# EAGLE design currentHack (EAGLE 8.3.1)
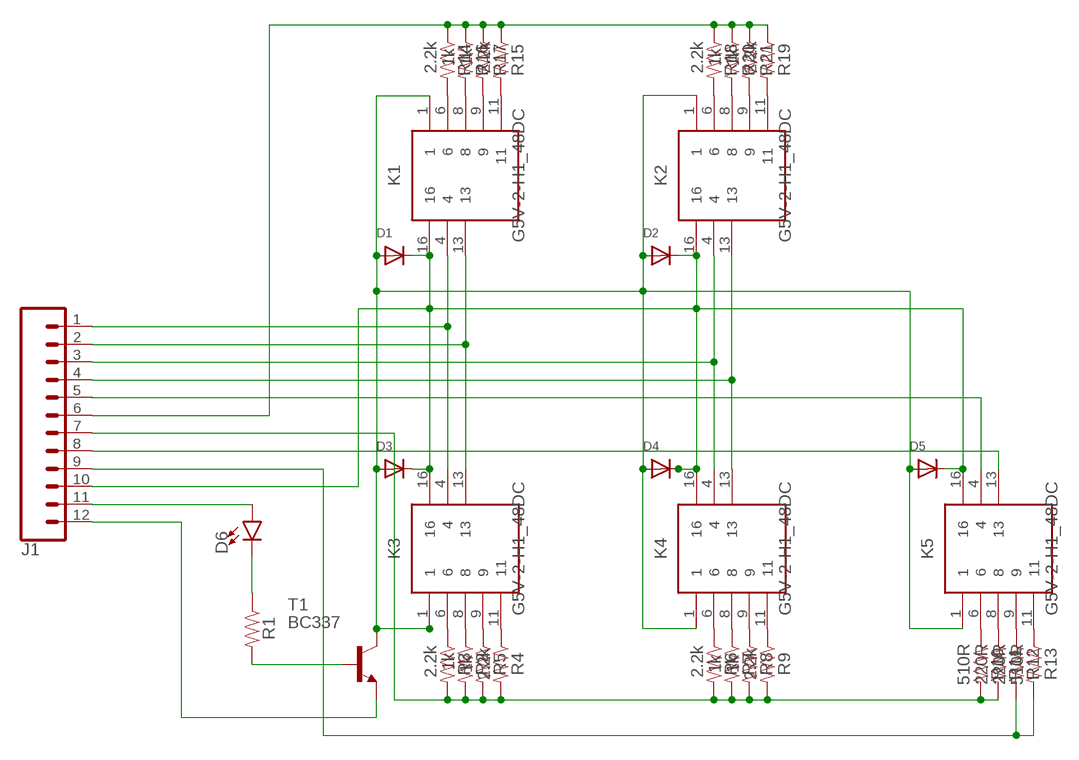
[diagram p0: schematic, sheet 1]

## Parts
D1  DIODEDO-1N4148  [DO-1N4148]
D2  DIODEDO-1N4148  [DO-1N4148]
D3  DIODEDO-1N4148  [DO-1N4148]
D4  DIODEDO-1N4148  [DO-1N4148]
D5  DIODEDO-1N4148  [DO-1N4148]
D6  LED3MM  [LED_3MM]
J1  CONN_12  [1X12]
K1  G5V-2-H1_48DC  [G5V-2-H1]
K2  G5V-2-H1_48DC  [G5V-2-H1]
K3  G5V-2-H1_48DC  [G5V-2-H1]
K4  G5V-2-H1_48DC  [G5V-2-H1]
K5  G5V-2-H1_48DC  [G5V-2-H1]
R1  RESISTORAXIAL-0.3  [AXIAL-0.3]
R2  1k  RESISTORAXIAL-0.3  [AXIAL-0.3]
R3  2.2k  RESISTORAXIAL-0.3  [AXIAL-0.3]
R4  2.2k  RESISTORAXIAL-0.3  [AXIAL-0.3]
R5  1k  RESISTORAXIAL-0.3  [AXIAL-0.3]
R6  2.2k  RESISTORAXIAL-0.3  [AXIAL-0.3]
R7  1k  RESISTORAXIAL-0.3  [AXIAL-0.3]
R8  1k  RESISTORAXIAL-0.3  [AXIAL-0.3]
R9  2.2k  RESISTORAXIAL-0.3  [AXIAL-0.3]
R10  510R  RESISTORAXIAL-0.3  [AXIAL-0.3]
R11  220R  RESISTORAXIAL-0.3  [AXIAL-0.3]
R12  220R  RESISTORAXIAL-0.3  [AXIAL-0.3]
R13  510R  RESISTORAXIAL-0.3  [AXIAL-0.3]
R14  2.2k  RESISTORAXIAL-0.3  [AXIAL-0.3]
R15  2.2k  RESISTORAXIAL-0.3  [AXIAL-0.3]
R16  1k  RESISTORAXIAL-0.3  [AXIAL-0.3]
R17  1k  RESISTORAXIAL-0.3  [AXIAL-0.3]
R18  2.2k  RESISTORAXIAL-0.3  [AXIAL-0.3]
R19  2.2k  RESISTORAXIAL-0.3  [AXIAL-0.3]
R20  1k  RESISTORAXIAL-0.3  [AXIAL-0.3]
R21  1k  RESISTORAXIAL-0.3  [AXIAL-0.3]
T1  BC337  [TO92]

## Nets
N$1: J1.3 K2.4 K4.4
N$2: J1.1 K1.4 K3.4
N$3: J1.2 K1.13 K3.13
N$4: J1.4 K2.13 K4.13
N$5: D6.A J1.11
N$6: D6.K(C) R1.P$1
N$7: R1.P$2 T1.2(B)
N$8: D1.A D2.A D3.A D4.A D5.A K1.1 K2.1 K3.1 K4.1 K5.1 T1.3(C)
N$9: K5.6 R10.P$1
N$10: D1.C D2.C D3.C D4.C D5.C J1.10 K1.16 K2.16 K3.16 K4.16 K5.16
N$11: K5.8 R11.P$1
N$12: K5.9 R12.P$1
N$13: K5.11 R13.P$1
N$14: K1.6 R14.P$2
N$15: K1.11 R15.P$2
N$16: K1.8 R16.P$2
N$17: K1.9 R17.P$2
N$19: J1.8 K5.13
N$20: J1.5 K5.4
N$21: J1.12 T1.1(E)
N$22: K3.8 R2.P$1
N$23: K3.6 R3.P$1
N$24: K3.11 R4.P$1
N$25: K3.9 R5.P$1
N$26: K4.6 R6.P$1
N$27: K4.8 R7.P$1
N$28: K4.9 R8.P$1
N$29: K4.11 R9.P$1
N$30: J1.7 R2.P$2 R3.P$2 R4.P$2 R5.P$2 R6.P$2 R7.P$2 R8.P$2 R9.P$2 R10.P$2 R11.P$2
N$32: J1.9 R12.P$2 R13.P$2
N$37: J1.6 R14.P$1 R15.P$1 R16.P$1 R17.P$1 R18.P$1 R19.P$1 R20.P$1 R21.P$1
N$38: K2.8 R20.P$2
N$39: K2.6 R18.P$2
N$40: K2.11 R19.P$2
N$41: K2.9 R21.P$2

## Library data of the parts
D1-D5 = adafruit:DIODE: Diode SMADIODE - SMA Surface Mount Package 20V 1A Schottky Diode Digikey: 641-1014-6-ND DO-1N4148 - Through Hole Small Current Diode SOD-123 20V 1 A (.5mV Vf) Schottky Diode - Digikey: MBRX120TPMSCT-ND SOD-323 10V 570mA (.38mV Vf, 3ns) Schottky Diode - Digikey: ZLLS410CT-ND SOD-523 30V 30mA Schottky Diode (RB751S-40TE61) - Digikey: RB751S-40TE61CT-ND SOT23-R/W - SOT23 Package (R = Solder Paste/Reflow Ovens, W = Hand-Soldering) BAT54Film 40V 300mA - Digikey: 497-7162-1-ND
D6 = SparkFun-LED:LED: LED (Generic) Standard schematic elements and footprints for 5mm, 3mm, 1206, and 0603 sized LEDs. Generic LEDs with no color specified.; PROD_ID: DIO-08794
J1 = SparkFun-Connectors:CONN_12: Multi connection point. Often used as Generic Header-pin footprint for 0.1 inch spaced/style header connections On any of the 0.1 inch spaced packages, you can populate with these: Break Away Headers - Straight <https://www.sparkfun.com/products/116> (PRT-00116) Break Away Male Headers - Right Angle <https://www.sparkfun.com/products/553> (PRT-00553) Female Headers <https://www.sparkfun.com/products/115> (PRT-00115) Break Away Headers - Machine Pin <https://www.sparkfun.com/products/117> (PRT-00117) Break Away Female Headers - Swiss Machine Pin <https://www.sparkfun.com/products/743> (PRT-00743) For SCREWTERMINALS and SPRING TERMINALS visit here: Screw Terimnals on SparkFun.com <https://www.sparkfun.com/search/results?term=Screw+Terminals> (5mm/3.5mm/2.54mm spacing) This device is also useful as a general connection point to wire up your design to another part of your project. Our various solder wires solder well into these plated through hole pads. Hook-Up Wire - Assortment (Stranded, 22 AWG) <https://www.sparkfun.com/products/11375> (PRT-11375) Hook-Up Wire - Assortment (Solid Core, 22 AWG) <https://www.sparkfun.com/products/11367> (PRT-11367) View the entire wire category on our website here <https://www.sparkfun.com/categories/141> Special notes: Molex polarized connector foot print use with SKU : PRT-08231 with associated crimp pins and housings. 1MM SMD Version SKU: PRT-10208 NOTES ON THE VARIANTS LOCK and LOCK_LONGPADS... This footprint was designed to help hold the alignment of a through-hole component (i.e. 6-pin header) while soldering it into place. You may notice that each hole has been shifted either up or down by 0.005 of an inch from it's more standard position (which is a perfectly straight line). This slight alteration caused the pins (the squares in the middle) to touch the edges of the holes. Because they are alternating, it causes a "brace" to hold the component in place. 0.005 has proven to be the perfect amount of "off-center" position when using our standard breakaway headers. Although looks a little odd when you look at the bare footprint, once you have a header in there, the alteration is very hard to notice. Also,if you push a header all the way into place, it is covered up entirely on the bottom side.
K1-K5 = G5V-2-H1_48DC:G5V-2-H1_48DC: Relay DPDT PCB ultra sensitive, 1A 48Vdc Omron DPDT PCB Mount Non-Latching Relay, 48V dc Coil <https://componentsearchengine.com/Images/3/G5V-2-H1+48DC.jpg> Source: Datasheet <http://uk.rs-online.com/web/p/products/6839270>; DESCRIPTION: Relay DPDT PCB ultra sensitive, 1A 48Vdc Omron DPDT PCB Mount Non-Latching Relay, 48V dc Coil; HEIGHT: mm; MANUFACTURER_NAME: Omron Electronics; MANUFACTURER_PART_NUMBER: G5V-2-H1 48DC; RS_PART_NUMBER: 6839270P; SUPPLIER_NAME: RS
R1-R21 = SparkFun-Resistors:RESISTOR: Generic Resistor Package
T1 = transistor:BC337: NPN TRANSISTOR

## Board
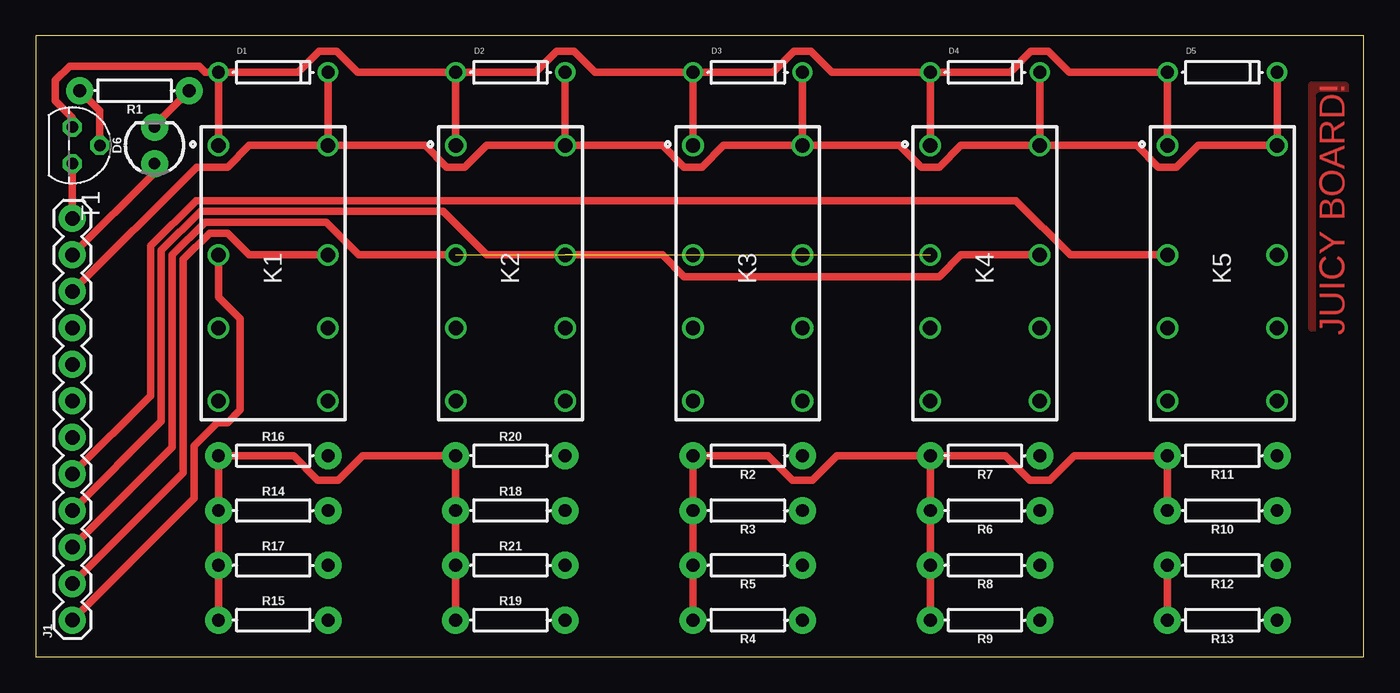
[diagram p1: board, top side]
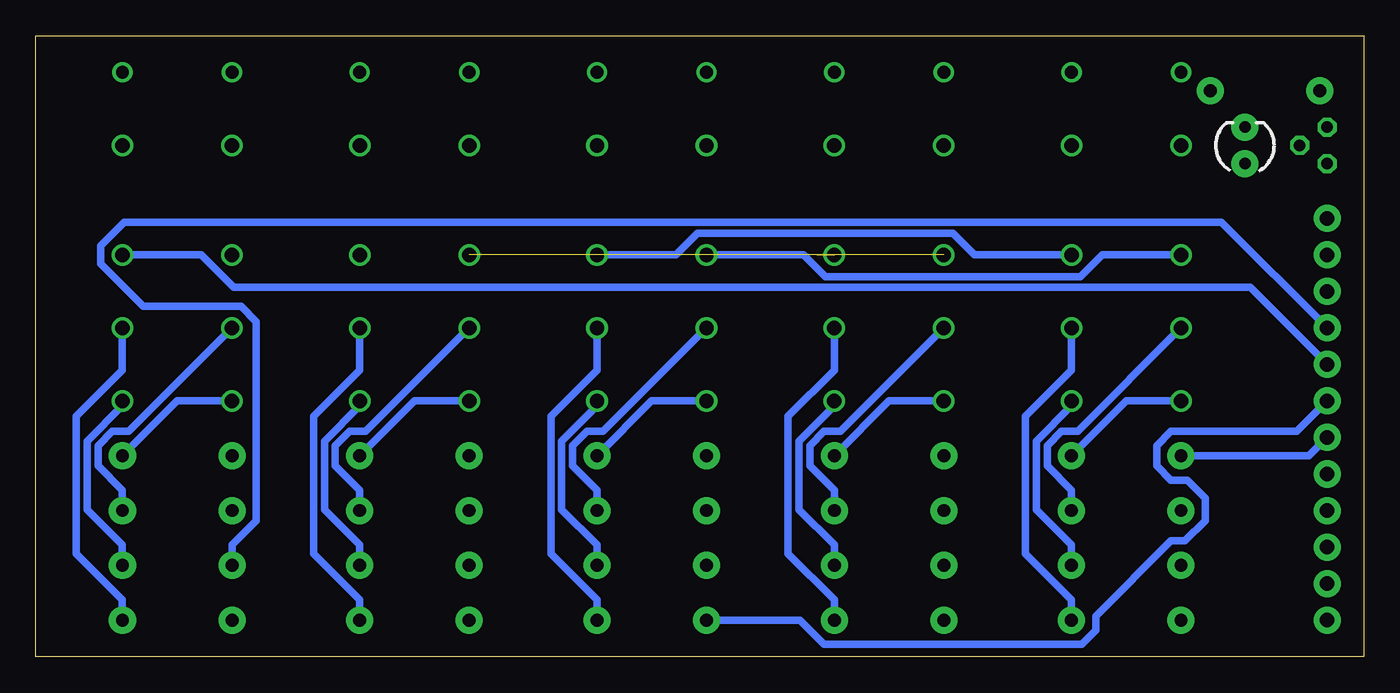
[diagram p2: board, bottom side, seen from below]

Size 92.38 x 43.17 mm. Coordinates in mm from the lower left corner, seen from the top.
Outline: 0,0 92.38,0 92.38,43.17 0,43.17 0,0
Copper layers (1*16): Top 0.035mm / dielectric 1.5mm / Bottom 0.035mm
Design rules "default *": minimum track width 6mil, minimum drill 0.35mm, track to track 0.25mm, track to pad 0.5mm, pad to pad 6mil, via to via 6mil, smd to smd 6mil, copper to edge 40mil, drill to drill 6mil, minimum pad ring 10mil, minimum via ring 8mil, stop-mask expansion 4mil, vias tented up to drill 0mil, thermal gap 10mil

### Footprints (pad centres in the part's own frame; a part is rotated, then mirrored left to right if it is on the bottom)
DO-1N4148 = drill 0.9: A -3.81,0; C 3.81,0
LED_3MM = drill 0.813 pad 1.88: A -1.27,0; K 1.27,0
1X12 = drill 1.016 pad 1.88: 1 0,0; 2 2.54,0; 3 5.08,0; 4 7.62,0; 5 10.16,0; 6 12.7,0; 7 15.24,0; 8 17.78,0; 9 20.32,0; 10 22.86,0; 11 25.4,0; 12 27.94,0
G5V-2-H1 = drill 1 pad 1.5: 1 -8.89,-3.81; 4 -1.27,-3.81; 6 3.81,-3.81; 8 8.89,-3.81; 9 8.89,3.81; 11 3.81,3.81; 13 -1.27,3.81; 16 -8.89,3.81
AXIAL-0.3 = drill 0.9 pad 1.88: P$1 -3.81,0; P$2 3.81,0
TO92 = drill 0.813 octagon: 1 1.27,0; 2 0,1.905; 3 -1.27,0

### Placement (x,y rotation side)
D1  16.51,40.64 0 top
D2  33.02,40.64 0 top
D3  49.53,40.64 0 top
D4  66.04,40.64 0 top
D5  82.55,40.64 0 top
D6  8.26,35.56 90 top
J1  2.54,2.54 90 top
K1  16.51,26.67 270 top
K2  33.02,26.67 270 top
K3  49.53,26.67 270 top
K4  66.04,26.67 270 top
K5  82.55,26.67 270 top
R1  6.86,39.37 180 top
R2  49.53,13.97 180 top
R3  49.53,10.16 180 top
R4  49.53,2.54 180 top
R5  49.53,6.35 180 top
R6  66.04,10.16 180 top
R7  66.04,13.97 180 top
R8  66.04,6.35 180 top
R9  66.04,2.54 180 top
R10  82.55,10.16 180 top
R11  82.55,13.97 180 top
R12  82.55,6.35 180 top
R13  82.55,2.54 180 top
R14  16.51,10.16 0 top
R15  16.51,2.54 0 top
R16  16.51,13.97 0 top
R17  16.51,6.35 0 top
R18  33.02,10.16 0 top
R19  33.02,2.54 0 top
R20  33.02,13.97 0 top
R21  33.02,6.35 0 top
T1  2.54,35.56 270 top

### Tracks (layer width: path | path; a pad name or v marks a point on that pad's centre or on a via)
N$1  (1 unrouted)
  Top 0.508: J1.3 9.49,14.57 9.49,27.93 11.76,30.21 20.19,30.21 22.45,27.94 K2.4
N$2
  Top 0.508: K1.4 12.7,24.99 14.21,23.49 14.21,17.16 13.32,16.27 12.61,16.27 11.01,14.67 11.01,11.01 J1.1
  Bottom 0.508: K1.4 18.19,27.94 19.7,26.43 37.45,26.43 38.96,27.94 K3.4
N$3
  Top 0.508: J1.2 10.25,12.79 10.25,27.62 12.07,29.45 13.32,29.45 14.83,27.94 K1.13
  Bottom 0.508: K1.13 27.08,27.94 28.59,29.45 46.34,29.45 47.85,27.94 K3.13
N$4  (1 unrouted)
  Top 0.508: J1.4 8.73,16.35 8.73,28.25 11.45,30.96 28.32,30.96 31.34,27.94 38.03,27.94 | K2.13 43.59,27.94 45.09,26.43 62.85,26.43 64.36,27.94 K4.13
N$5
  Top 0.508: J1.11 8.26,33.66 D6.A
N$6
  Top 0.508: 8.26,36.96 D6.K 8.26,36.96 | 8.26,36.96 R1.P$1
N$7
  Top 0.508: T1.2 4.45,37.97 R1.P$2
N$8
  Top 0.508: K1.1 D1.A | K3.1 D3.A | K4.1 D4.A | K5.1 D5.A 71.91,40.64 70.45,42.1 69.25,42.1 67.79,40.64 D4.A | D1.A 11.79,40.64 11.37,41.06 2.35,41.06 1.35,40.07 1.35,38.67 2.54,37.48 T1.3 | D1.A 18.26,40.64 19.72,42.1 20.92,42.1 22.38,40.64 D2.A | K2.1 D2.A | D2.A 34.77,40.64 36.23,42.1 37.43,42.1 38.89,40.64 D3.A | D3.A 51.28,40.64 52.74,42.1 53.94,42.1 55.4,40.64 D4.A
N$9
  Bottom 0.508: K5.6 85.94,15.66 87.06,15.66 88.05,14.67 88.05,13.27 86.36,11.57 R10.P$1
N$10
  Top 0.508: K1.16 D1.C | K3.16 D3.C | K4.16 D4.C | D5.C K5.16 80.87,35.56 79.36,34.05 78.11,34.05 76.61,35.56 K4.16 | D2.C K2.16 | K1.16 27.08,35.56 28.59,34.05 29.84,34.05 31.34,35.56 K2.16 | J1.10 11.19,34.05 13.32,34.05 14.83,35.56 K1.16 | K3.16 60.1,35.56 61.6,34.05 62.85,34.05 64.36,35.56 K4.16 | K2.16 43.59,35.56 45.09,34.05 46.34,34.05 47.85,35.56 K3.16
N$11
  Bottom 0.508: R11.P$1 82.55,17.78 K5.8
N$12
  Bottom 0.508: K5.9 86.36,17.44 88.81,14.99 88.81,10.22 86.36,7.77 R12.P$1
N$13
  Bottom 0.508: K5.11 86.36,19.91 89.57,16.7 89.57,7.16 86.36,3.96 R13.P$1
N$14
  Bottom 0.508: K1.6 19.9,15.66 21.02,15.66 22.01,14.67 22.01,13.27 20.32,11.57 R14.P$2
N$15
  Bottom 0.508: K1.11 20.32,19.91 23.53,16.7 23.53,7.16 20.32,3.96 R15.P$2
N$16
  Bottom 0.508: R16.P$2 16.51,17.78 K1.8
N$17
  Bottom 0.508: K1.9 20.32,17.44 22.77,14.99 22.77,10.22 20.32,7.77 R17.P$2
N$19
  Bottom 0.508: K5.13 80.87,27.94 78.61,25.67 7.89,25.67 J1.8
N$20
  Top 0.508: J1.5 7.97,18.13 7.97,28.56 11.13,31.72 68.2,31.72 71.98,27.94 K5.4
N$21
  Top 0.508: J1.12 T1.1
N$22
  Bottom 0.508: R2.P$1 49.53,17.78 K3.8
N$23
  Bottom 0.508: K3.6 52.92,15.66 54.04,15.66 55.03,14.67 55.03,13.27 53.34,11.57 R3.P$1
N$24
  Bottom 0.508: K3.11 53.34,19.91 56.55,16.7 56.55,7.16 53.34,3.96 R4.P$1
N$25
  Bottom 0.508: K3.9 53.34,17.44 55.79,14.99 55.79,10.22 53.34,7.77 R5.P$1
N$26
  Bottom 0.508: K4.6 69.43,15.66 70.55,15.66 71.54,14.67 71.54,13.27 69.85,11.57 R6.P$1
N$27
  Bottom 0.508: R7.P$1 66.04,17.78 K4.8
N$28
  Bottom 0.508: K4.9 69.85,17.44 72.3,14.99 72.3,10.22 69.85,7.77 R8.P$1
N$29
  Bottom 0.508: K4.11 69.85,19.91 73.06,16.7 73.06,7.16 69.85,3.96 R9.P$1
N$30
  Top 0.508: R4.P$2 R5.P$2 R3.P$2 R2.P$2 50.95,13.97 52.64,12.28 54.04,12.28 55.73,13.97 R7.P$2 | R9.P$2 R8.P$2 R6.P$2 R7.P$2 | R10.P$2 R11.P$2 72.25,13.97 70.55,12.28 69.15,12.28 67.45,13.97 R7.P$2
  Bottom 0.508: J1.7 4.66,15.66 13.4,15.66 14.39,14.67 14.39,13.27 13.4,12.28 12.28,12.28 11.01,11.01 11.01,9.46 12.42,8.04 13.4,8.04 18.63,2.82 18.63,1.84 19.62,0.85 37.53,0.85 39.23,2.54 R4.P$2
N$32
  Top 0.508: R13.P$2 R12.P$2
  Bottom 0.508: J1.9 9.89,30.21 86.23,30.21 87.87,28.57 87.87,27.32 84.92,24.37 78.11,24.37 77.05,23.3 77.05,9.46 78.74,7.77 R12.P$2
N$37
  Top 0.508: R15.P$1 R17.P$1 R14.P$1 R16.P$1 17.93,13.97 19.62,12.28 21.02,12.28 22.71,13.97 R20.P$1 R18.P$1 R21.P$1 R19.P$1
  Bottom 0.508: J1.6 3.81,13.97 R16.P$1
N$38
  Bottom 0.508: R20.P$2 33.02,17.78 K2.8
N$39
  Bottom 0.508: K2.6 36.41,15.66 37.53,15.66 38.52,14.67 38.52,13.27 36.83,11.57 R18.P$2
N$40
  Bottom 0.508: K2.11 36.83,19.91 40.04,16.7 40.04,7.16 36.83,3.96 R19.P$2
N$41
  Bottom 0.508: K2.9 36.83,17.44 39.28,14.99 39.28,10.22 36.83,7.77 R21.P$2
POLYGON
  pour Top: 88.77,22.86 88.77,39.75 91.06,39.75 91.44,39.37 91.44,22.61 89.28,22.61 89.15,22.61 88.9,22.86

### Text on the board
Top: JUICY BOARD!